# EAGLE schematic od808_redraw (EAGLE 8.5.1)
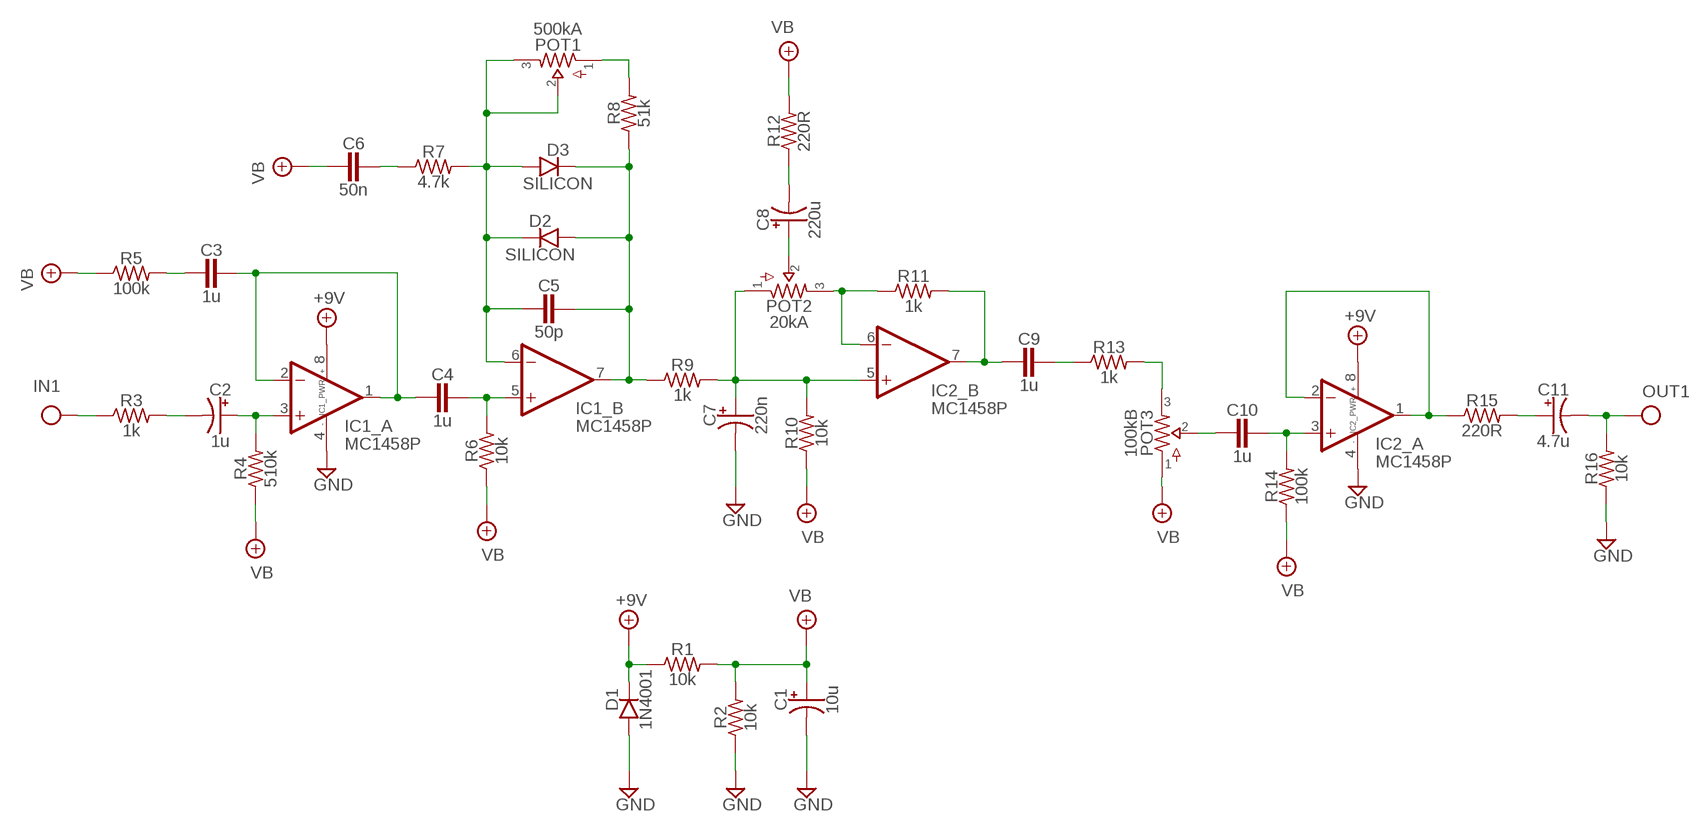
[diagram p0: schematic, sheet 1]

## Parts
C1  10u  0500  [050_020]
C2  1u  0500  [050_020]
C3  1u  CER/FILMBOX.1  [BOX_SMALL]
C4  1u  CER/FILMBOX.1  [BOX_SMALL]
C5  50p  CER/FILMBOX.1  [BOX_SMALL]
C6  50n  CER/FILMBOX.1  [BOX_SMALL]
C7  220n  0500  [050_020]
C8  220u  0500  [050_020]
C9  1u  CER/FILMBOX.1  [BOX_SMALL]
C10  1u  CER/FILMBOX.1  [BOX_SMALL]
C11  4.7u  0500  [050_020]
D1  1N4001  DO35.2  [DO35-2]
D2  SILICON  DO35.2  [DO35-2]
D3  SILICON  DO35.2  [DO35-2]
IC1  MC1458P  DUALTH  [DIL0]
IC2  MC1458P  DUALTH  [DIL0]
POT1  500kA  POTS16MM  [16MM]
POT2  20kA  POTS16MM  [16MM]
POT3  100kB  POTS16MM  [16MM]
R1  10k  R_.3B  [R0207/3]
R2  10k  R_.3B  [R0207/3]
R3  1k  R_.3B  [R0207/3]
R4  510k  R_.3B  [R0207/3]
R5  100k  R_.3B  [R0207/3]
R6  10k  R_.3B  [R0207/3]
R7  4.7k  R_.3B  [R0207/3]
R8  51k  R_.3B  [R0207/3]
R9  1k  R_.3B  [R0207/3]
R10  10k  R_.3B  [R0207/3]
R11  1k  R_.3B  [R0207/3]
R12  220R  R_.3B  [R0207/3]
R13  1k  R_.3B  [R0207/3]
R14  100k  R_.3B  [R0207/3]
R15  220R  R_.3B  [R0207/3]
R16  10k  R_.3B  [R0207/3]

## Nets
+9V: D1.C IC1.8(_PWR:V+) IC2.8(_PWR:V+) R1.1
GND: C1.- C7.- D1.A IC1.4(_PWR:V-) IC2.4(_PWR:V-) R2.1 R16.1
IN: R3.1
N$3: IC2.6(_B:-IN) POT2.3 R11.1
N$4: C9.2 IC2.7(_B:OUT) R11.2
N$5: C2.- R3.2
N$6: C2.+ IC1.3(_A:+IN) R4.2
N$7: C3.1 C4.2 IC1.1(_A:OUT) IC1.2(_A:-IN)
N$8: C3.2 R5.2
N$9: C4.1 IC1.5(_B:+IN) R6.2
N$10: C5.2 D2.C D3.A IC1.6(_B:-IN) POT1.2 POT1.3 R7.2
N$11: POT1.1 R8.2
N$12: C5.1 D2.A D3.C IC1.7(_B:OUT) R8.1 R9.1
N$13: C6.1 R7.1
N$14: C8.+ POT2.2
N$15: C7.+ IC2.5(_B:+IN) POT2.1 R9.2 R10.2
N$16: C8.- R12.1
N$17: POT3.3 R13.2
N$18: C9.1 R13.1
N$19: C10.2 POT3.2
N$20: C10.1 IC2.3(_A:+IN) R14.2
N$21: IC2.1(_A:OUT) IC2.2(_A:-IN) R15.1
N$22: C11.+ R15.2
OUT: C11.- R16.2
VB: C1.+ C6.2 POT3.1 R1.2 R2.2 R4.1 R5.1 R6.1 R10.1 R12.2 R14.1

## Library data of the parts
C1 C2 C7 C8 C11 = pedals-capacitors-elec:050
C3-C6 C9 C10 = pedals-capacitors-film:CER/FILM: 47 - 120pF Xicon Ceramic Disc 2.5mm lead spacing
D1-D3 = pedals-diodes:DO35: DO-35 Package Diodes: 1N914
IC1 IC2 = pedals-integrated circuits:DUAL: OP AMP
POT1-POT3 = pedals-potentiometers:POTS
R1-R16 = pedals-resistors:R_